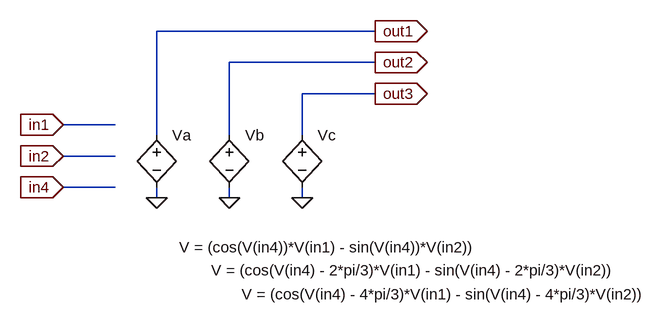
[diagram p0: schematic DQ-ABC.asc]
DQ-ABC.asc, the LTspice schematic file:
Version 4
SHEET 1 1920 680
WIRE 752 -32 416 -32
WIRE 752 16 528 16
WIRE 752 64 640 64
WIRE 352 112 272 112
WIRE 416 128 416 -32
WIRE 528 128 528 16
WIRE 640 128 640 64
WIRE 352 160 272 160
WIRE 352 208 272 208
WIRE 416 224 416 208
WIRE 528 224 528 208
WIRE 640 224 640 208
FLAG 272 112 in1
IOPIN 272 112 In
FLAG 272 160 in2
IOPIN 272 160 In
FLAG 272 208 in4
IOPIN 272 208 In
FLAG 416 224 0
FLAG 528 224 0
FLAG 752 -32 out1
IOPIN 752 -32 Out
FLAG 752 16 out2
IOPIN 752 16 Out
FLAG 640 224 0
FLAG 752 64 out3
IOPIN 752 64 Out
SYMBOL bv 416 112 R0
WINDOW 3 35 188 Left 2
SYMATTR Value V = (cos(V(in4))*V(in1) - sin(V(in4))*V(in2))
SYMATTR InstName Va
SYMBOL bv 528 112 R0
WINDOW 3 -28 224 Left 2
SYMATTR Value V = (cos(V(in4) - 2*pi/3)*V(in1) - sin(V(in4) - 2*pi/3)*V(in2))
SYMATTR InstName Vb
SYMBOL bv 640 112 R0
WINDOW 3 -93 261 Left 2
SYMATTR Value V = (cos(V(in4) - 4*pi/3)*V(in1) - sin(V(in4) - 4*pi/3)*V(in2))
SYMATTR InstName Vc

The netlist it stands for:
* DQ-ABC.asc
B§Va out1 0 V = (cos(V(in4))*V(in1) - sin(V(in4))*V(in2))
B§Vb out2 0 V = (cos(V(in4) - 2*pi/3)*V(in1) - sin(V(in4) - 2*pi/3)*V(in2))
B§Vc out3 0 V = (cos(V(in4) - 4*pi/3)*V(in1) - sin(V(in4) - 4*pi/3)*V(in2))
.backanno
.end